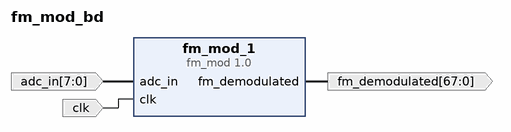
[diagram p0: block diagram of the top level]
# Vivado block design fm_mod_bd, xc7s50csga324-2, Vivado 2018.3
create_bd_design fm_mod_bd

create_bd_port -dir I -from 7 -to 0 -type data adc_in
create_bd_port -dir I -type clk clk
create_bd_port -dir O -from 67 -to 0 -type data fm_demodulated

create_bd_cell -type ip -vlnv User_Company:SysGen:fm_mod:1.0 fm_mod_1

# ---- connections ----

connect_bd_net [get_bd_ports adc_in] [get_bd_pins fm_mod_1/adc_in]
connect_bd_net [get_bd_ports clk] [get_bd_pins fm_mod_1/clk]
connect_bd_net [get_bd_pins fm_mod_1/fm_demodulated] [get_bd_ports fm_demodulated]

validate_bd_design
save_bd_design
